# EAGLE design china_mp3_board (EAGLE 7.5.0)
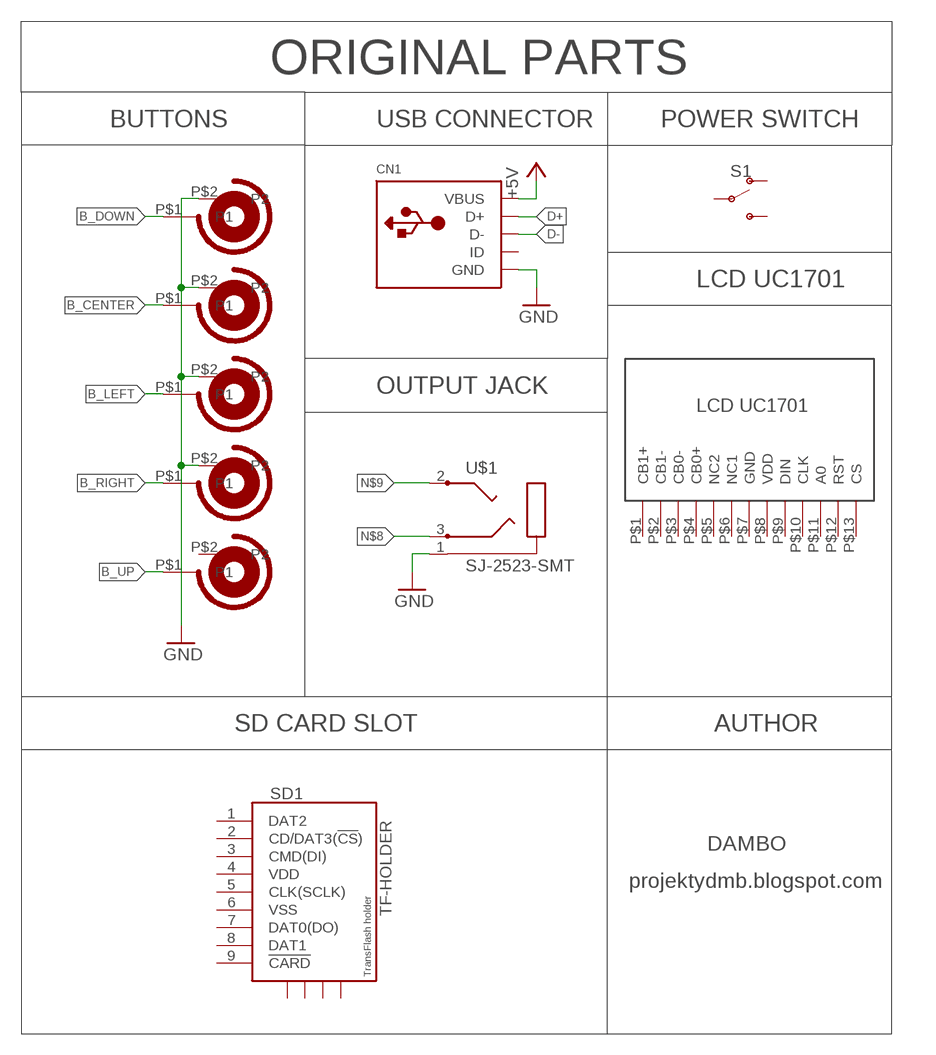
[diagram p0: schematic, sheet 1]

## Parts
CN1  USBMINIB  [USB-MINIB]
S1  SWITCH-SPDT-SMD-RIGHT-ANGLE  [SWITCH_SPST_SMD_A]
SD1  TF-HOLDER  [TF-PULL]
U$1  SJ-2523-SMT  [SJ-2523-SMT]
U$2  BUTTON_TACT  [BUTTON_TACT_PACKAGE]
U$3  BUTTON_TACT  [BUTTON_TACT_PACKAGE]
U$4  BUTTON_TACT  [BUTTON_TACT_PACKAGE]
U$5  BUTTON_TACT  [BUTTON_TACT_PACKAGE]
U$6  BUTTON_TACT  [BUTTON_TACT_PACKAGE]
U$7  CHINA_MP3_LCD  [ONLY_PINS]

## Nets
+5V: CN1.VBUS
B_CENTER: U$3.P$1(P1)
B_DOWN: U$2.P$1(P1)
B_LEFT: U$4.P$1(P1)
B_RIGHT: U$5.P$1(P1)
B_UP: U$6.P$1(P1)
D+: CN1.D+
D-: CN1.D-
GND: CN1.GND U$1.1(EARTH) U$2.P$2(P2) U$3.P$2(P2) U$4.P$2(P2) U$5.P$2(P2)
N$8: U$1.3(RING)
N$9: U$1.2(TIP)
Unconnected: CN1.ID S1.1(O) S1.2(P) S1.3(S) SD1.1(DAT2) SD1.2(CD/DAT3(!CS!)) SD1.3(CMD(DI)) SD1.5(CLK(SCLK)) SD1.7(DAT0(DO)) SD1.8(DAT1) SD1.9(!CARD) SD1.S1 SD1.S2 SD1.S3 SD1.S4 U$6.P$2(P2) U$7.P$1(CB1+) U$7.P$2(CB1-) U$7.P$3(CB0-) U$7.P$4(CB0+) U$7.P$5(NC2) U$7.P$6(NC1) U$7.P$7(GND) U$7.P$8(VDD) U$7.P$9(DIN) U$7.P$10(CLK) U$7.P$11(A0) U$7.P$12(RST) U$7.P$13(CS)

## Notes on the sheet
- ORIGINAL PARTS
- BUTTONS | USB CONNECTOR | POWER SWITCH
- LCD UC1701
- OUTPUT JACK
- SD CARD SLOT | AUTHOR
- DAMBO
- projektydmb.blogspot.com

## Power pins joined to a net without a drawn wire
VDD: SD1.4(VDD)
VSS: SD1.6(VSS)

## Library data of the parts
CN1 = adafruit:USB: USB Connectors USBMINIB - Surface Mount Female Mini-B USB Connector 4UConnector: 06564 By microbuilder.eu Thru-hole RA Female Mini-B USB Connector 4UConnector: 18732 By ladyada.net
S1 = SparkFun-Switches:SWITCH-SPDT: Single Pole, Double Throw (SPDT) Switch Single-pole, double-throw (SPDT) switch. Variant Overview SMD-AYZ0202 Surface Mount DPDT Switch <https://www.sparkfun.com/products/597> (COM-00597) Used on e.g. LilyPad Arduino USB - ATmega32U4 Board <https://www.sparkfun.com/products/12049> PTH-11.6X4.0MM SPDT Mini Power Switch <https://www.sparkfun.com/products/102> (COM-00102) Used on e.g. SparkFun Simon Says - Through-Hole Soldering Kit <https://www.sparkfun.com/products/10547> (KIT-10547) PTH-11.6X4.0MM-KIT KIT version of SPDT Mini Power Switch - Simplifies soldering by removing tStop of switch pins - only one side can be soldered. PTH-11.6X4.0MM-LOCK LOCK version of SPDT Mini Power Switch - Offset pins hold switch in place for easier soldering. SMD-RIGHT-ANGLE Surface Mount Right Angle Switch <https://www.sparkfun.com/products/10860> (COM-10860) Used on e.g. SparkFun ESP8266 Thing <https://www.sparkfun.com/products/13231>; PROD_ID: SWCH-10651; SF_SKU: COM-10860
SD1 = sd-mmc:TF-HOLDER: TF / Micro SD socket is PUSH-PUSH type, the card can be pushed into and auto locked and pushed out by simply press the card. Surface Mounting type.
U$1 = con-cuistack:SJ-2523: 2.5 Stereo Audio Jack (SMT)
U$2-U$6 = buttons_mp3:BUTTON_TACT
U$7 = china_mp3_lcd:CHINA_MP3_LCD

## Board
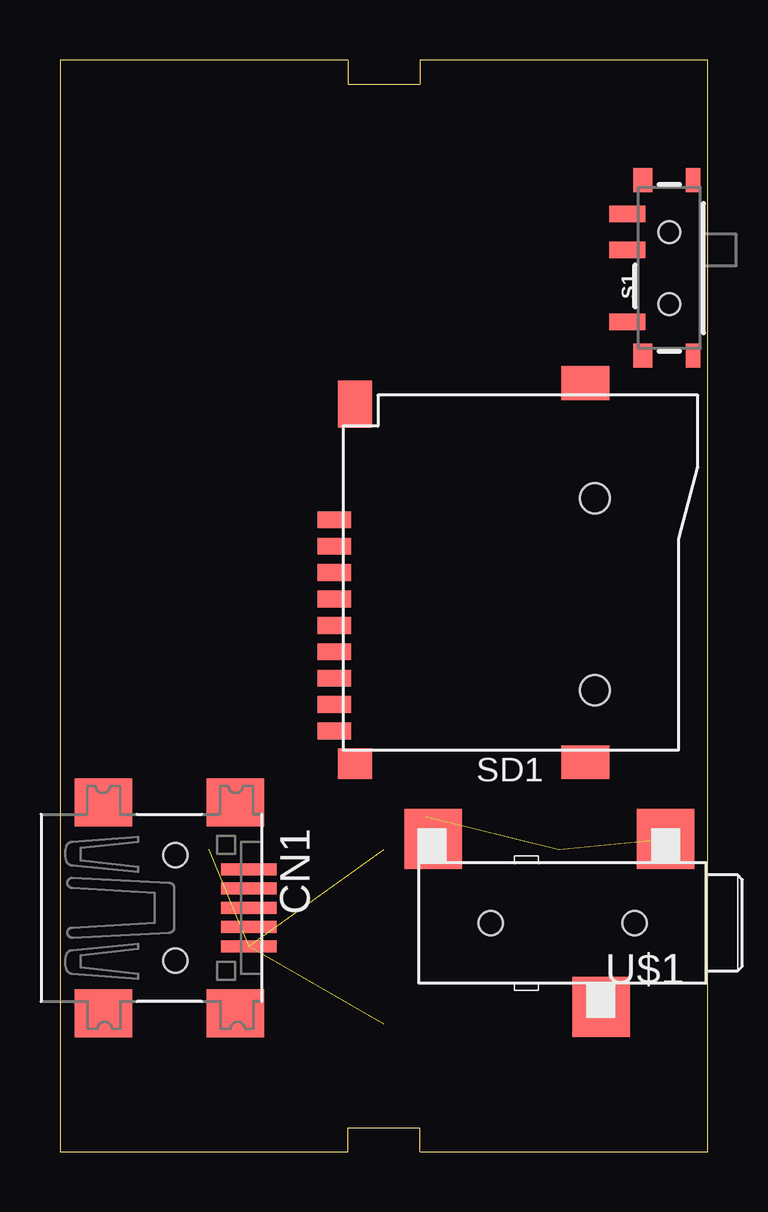
[diagram p1: board, top side]
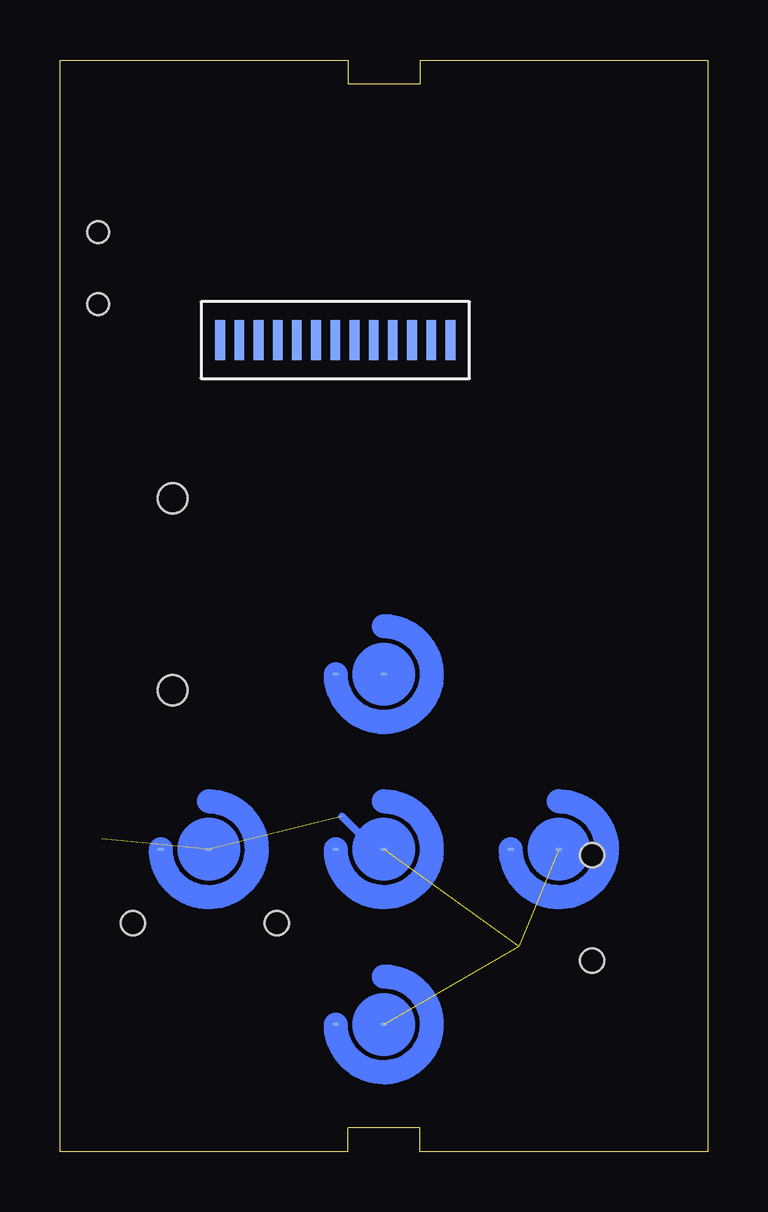
[diagram p2: board, bottom side, seen from below]

Size 27 x 45.5 mm. Coordinates in mm from the lower left corner, seen from the top.
Outline: 0,0 12,0 12,1 15,1 15,0 27,0 27,45.5 15,45.5 15,44.5 12,44.5 12,45.5 0,45.5 0,0
Copper layers (1*16): Top 0.035mm / dielectric 1.5mm / Bottom 0.035mm
Design rules "default": minimum track width 10mil, minimum drill 24mil, track to track 8mil, track to pad 8mil, pad to pad 8mil, via to via 8mil, smd to smd 8mil, copper to edge 40mil, drill to drill 8mil, minimum pad ring 10mil, minimum via ring 8mil, stop-mask expansion 4mil, vias tented up to drill 0mil, thermal gap 10mil

### Footprints (pad centres in the part's own frame; a part is rotated, then mirrored left to right if it is on the bottom)
USB-MINIB = smd 0.5 x 2.308: D+ 0,4.064; D- -0.8,4.064; GND 1.6,4.064; ID 0.8,4.064; VBUS -1.6,4.064 | smd 2 x 2.4: GND1 -4.4,-2; GND2 -4.4,3.5; GND3 4.4,3.5; GND4 4.4,-2 | hole 1: -2.2,1; 2.2,1
SWITCH_SPST_SMD_A = smd 0.7 x 1.5: 1 -2.25,-1.75; 2 -0.75,-1.75; 3 2.25,-1.75 | smd 1 x 0.6: GND1 -3.65,1; GND3 3.65,1 | smd 1 x 0.8: GND2 -3.65,-1.1; GND4 3.65,-1.1 | hole 0.9: -1.5,0; 1.5,0
TF-PULL = smd 0.7 x 1.4: 1 -2.2,-7.62; 2 -1.1,-7.62; 3 0,-7.62; 4 1.1,-7.62; 5 2.2,-7.62; 6 3.3,-7.62; 7 4.4,-7.62; 8 5.5,-7.62; 9 6.6,-7.62 | smd 1.4 x 2: S1 -7.9,2.85; S2 7.9,2.85 | smd 1.28 x 1.4: S3 7.96,-6.75 | smd 1.95 x 1.4: S4 -7.025,-6.75 | hole 1.25: -3.1,3.25; 4.9,3.25
SJ-2523-SMT = smd 2.5 x 2.4: 1 3.5,-4.3; 2 3.5,5.4; 3 -3.5,-1.6 | hole 1: 0,-3; 0,3
BUTTON_TACT_PACKAGE = smd 0.305 x 0.152: P$1 -2,0; P$2 0,0
ONLY_PINS = smd 0.406 x 1.676: P$1 0,0.8; P$2 0.8,0.8; P$3 1.6,0.8; P$4 2.4,0.8; P$5 3.2,0.8; P$6 4,0.8; P$7 4.8,0.8; P$8 5.6,0.8; P$9 6.4,0.8; P$10 7.2,0.8; P$11 8,0.8; P$12 8.8,0.8; P$13 9.6,0.8

### Placement (x,y rotation side)
CN1  3.81,10.16 270 top
S1  25.4,36.83 270 top
SD1  19.05,24.13 270 top
U$1  20.95,9.53 90 top
U$2  13.5,5.3 0 bottom
U$3  13.5,12.6 0 bottom
U$4  6.2,12.6 0 bottom
U$5  20.8,12.6 0 bottom
U$6  13.5,19.9 0 bottom
U$7  20.32,33.02 0 bottom

### Tracks (layer width: path | path; a pad name or v marks a point on that pad's centre or on a via)
GND  (5 unrouted)
  Bottom 0.305: U$3.P$2 13.87,12.6 15.24,13.97